# EAGLE design Placa alimentacion (EAGLE 7.5.0)
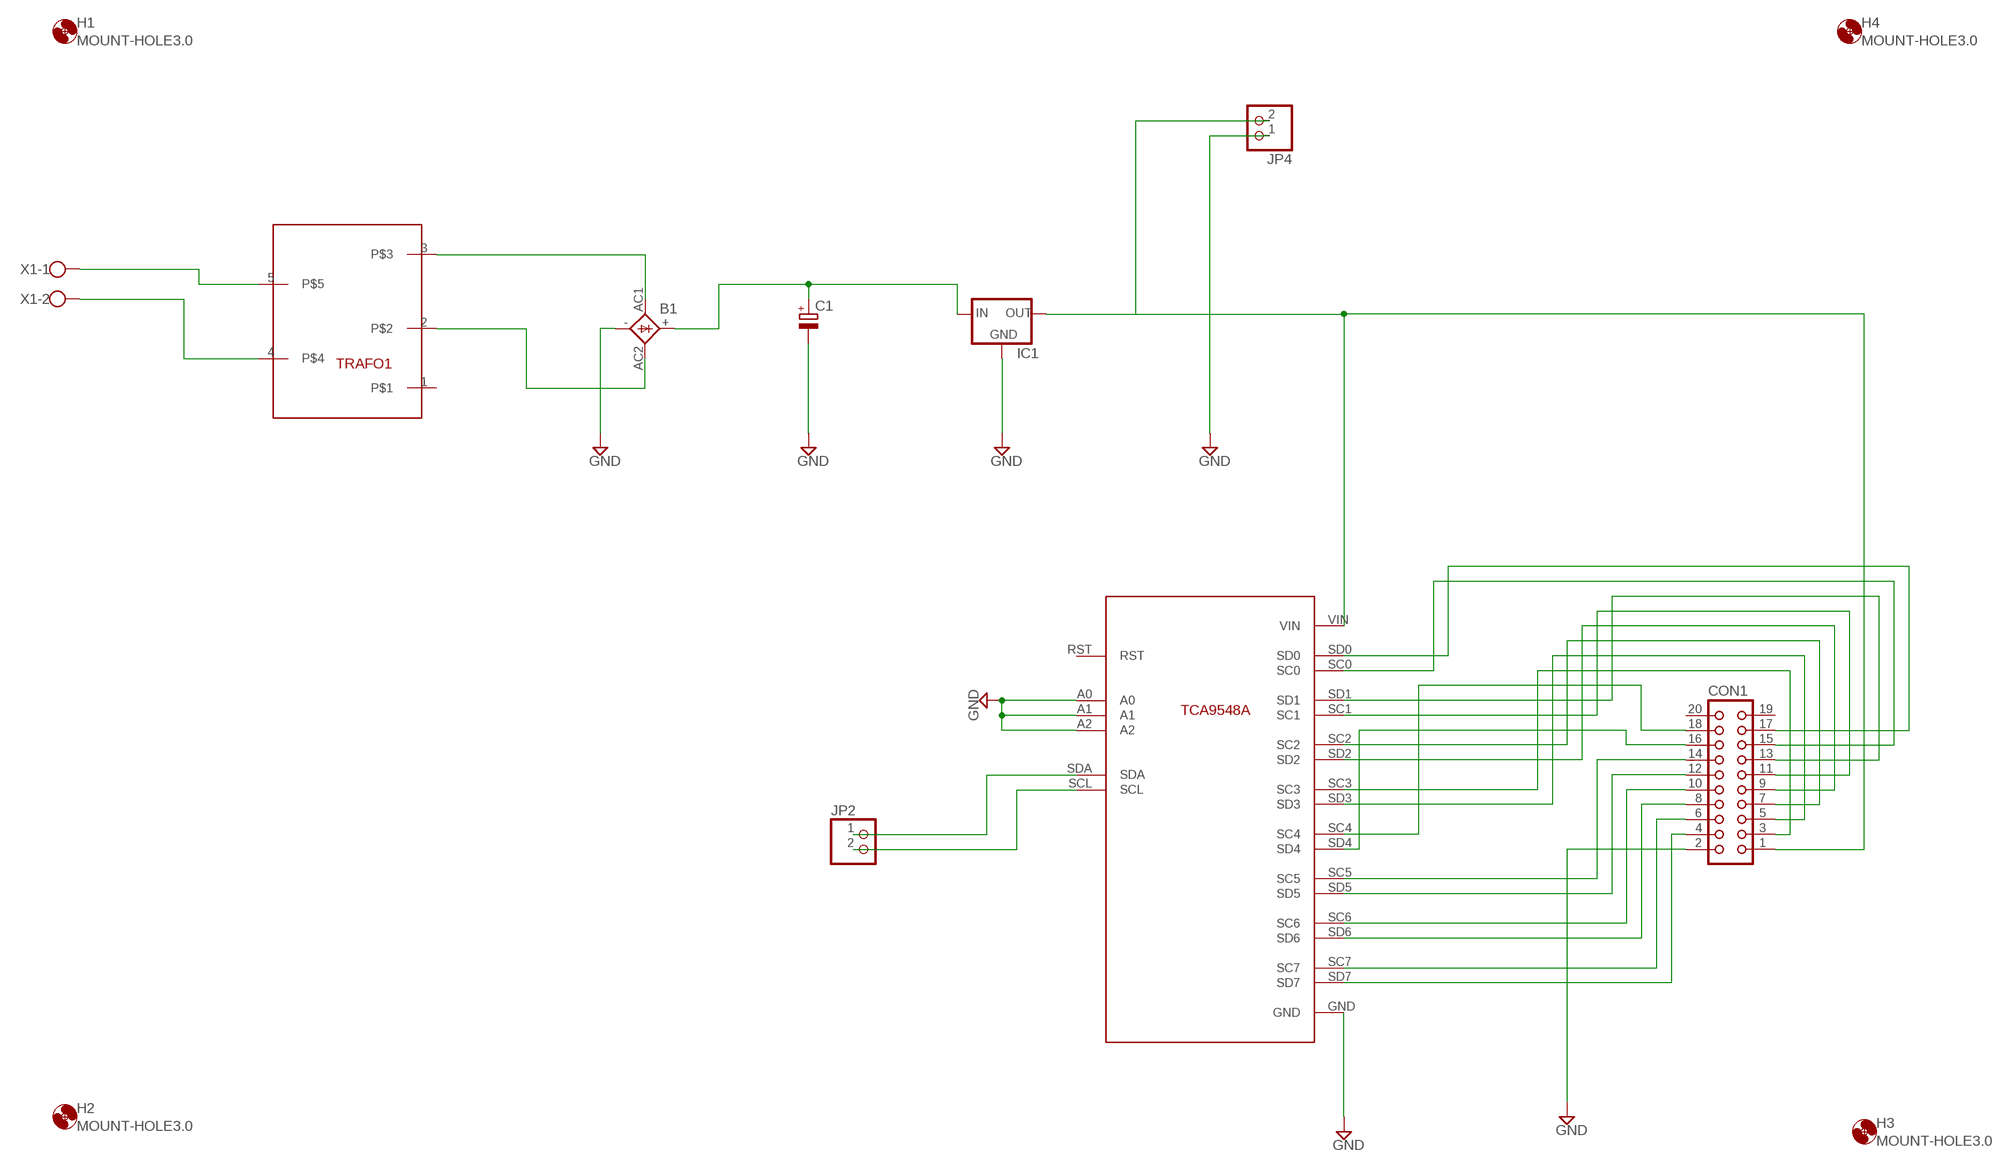
[diagram p0: schematic, sheet 1]

## Parts
B1  KBU  [KBU]
C1  CPOL-EUE5-8.5  [E5-8,5]
CON1  CON20  [CON20]
H1  MOUNT-HOLE3.0  [3,0]
H2  MOUNT-HOLE3.0  [3,0]
H3  MOUNT-HOLE3.0  [3,0]
H4  MOUNT-HOLE3.0  [3,0]
IC1  78MXXL  [78MXXL]
JP2  PINHD-1X2  [1X02]
JP4  PINHD-1X2  [1X02]
TRAFO1  ARISTON_TR5309  [ARISTON_TR5309]
U$1  TCA9548A  [TCA9548A]
X1  W237-102  [W237-102]

## Nets
GND: B1.- C1.- CON1.2 IC1.GND JP4.1 U$1.A0 U$1.A1 U$1.A2 U$1.GND
N$1: TRAFO1.5 X1.1
N$2: TRAFO1.4 X1.2
N$3: B1.AC1 TRAFO1.3
N$4: B1.AC2 TRAFO1.2
N$5: B1.+ C1.+ IC1.IN
N$6: CON1.3 U$1.SC3
N$7: CON1.5 U$1.SD3
N$8: CON1.7 U$1.SC2
N$9: CON1.9 U$1.SD2
N$10: CON1.11 U$1.SC1
N$11: CON1.13 U$1.SD1
N$12: CON1.15 U$1.SC0
N$13: CON1.17 U$1.SD0
N$14: CON1.4 U$1.SD7
N$15: CON1.6 U$1.SC7
N$16: CON1.8 U$1.SD6
N$17: CON1.10 U$1.SC6
N$18: CON1.12 U$1.SD5
N$19: CON1.14 U$1.SC5
N$20: CON1.16 U$1.SD4
N$21: CON1.18 U$1.SC4
N$25: CON1.1 IC1.OUT JP4.2 U$1.VIN
N$30: JP2.1 U$1.SDA
N$31: JP2.2 U$1.SCL
Unconnected: CON1.19 CON1.20 TRAFO1.1 U$1.RST

## Library data of the parts
B1 = rectifier:KBU: DIOTEC RECTIFIER
C1 = rcl:CPOL-EU: POLARIZED CAPACITOR, European symbol
CON1 = con-harting:CON20: CONNECTOR; OC_FARNELL: unknown; OC_NEWARK: unknown
H1-H4 = holes:MOUNT-HOLE: MOUNTING HOLE with drill center marker
IC1 = v-reg:78MXXL: VOLTAGE REGULATOR
JP2 JP4 = pinhead:PINHD-1X2: PIN HEADER
TRAFO1 = CESAR:ARISTON_TR5309
U$1 = CESAR:TCA9548A
X1 = con-wago-500:W237-102: WAGO SCREW CLAMP; MPN: 237-102; OC_FARNELL: unknown; OC_NEWARK: 70K9898

## Board
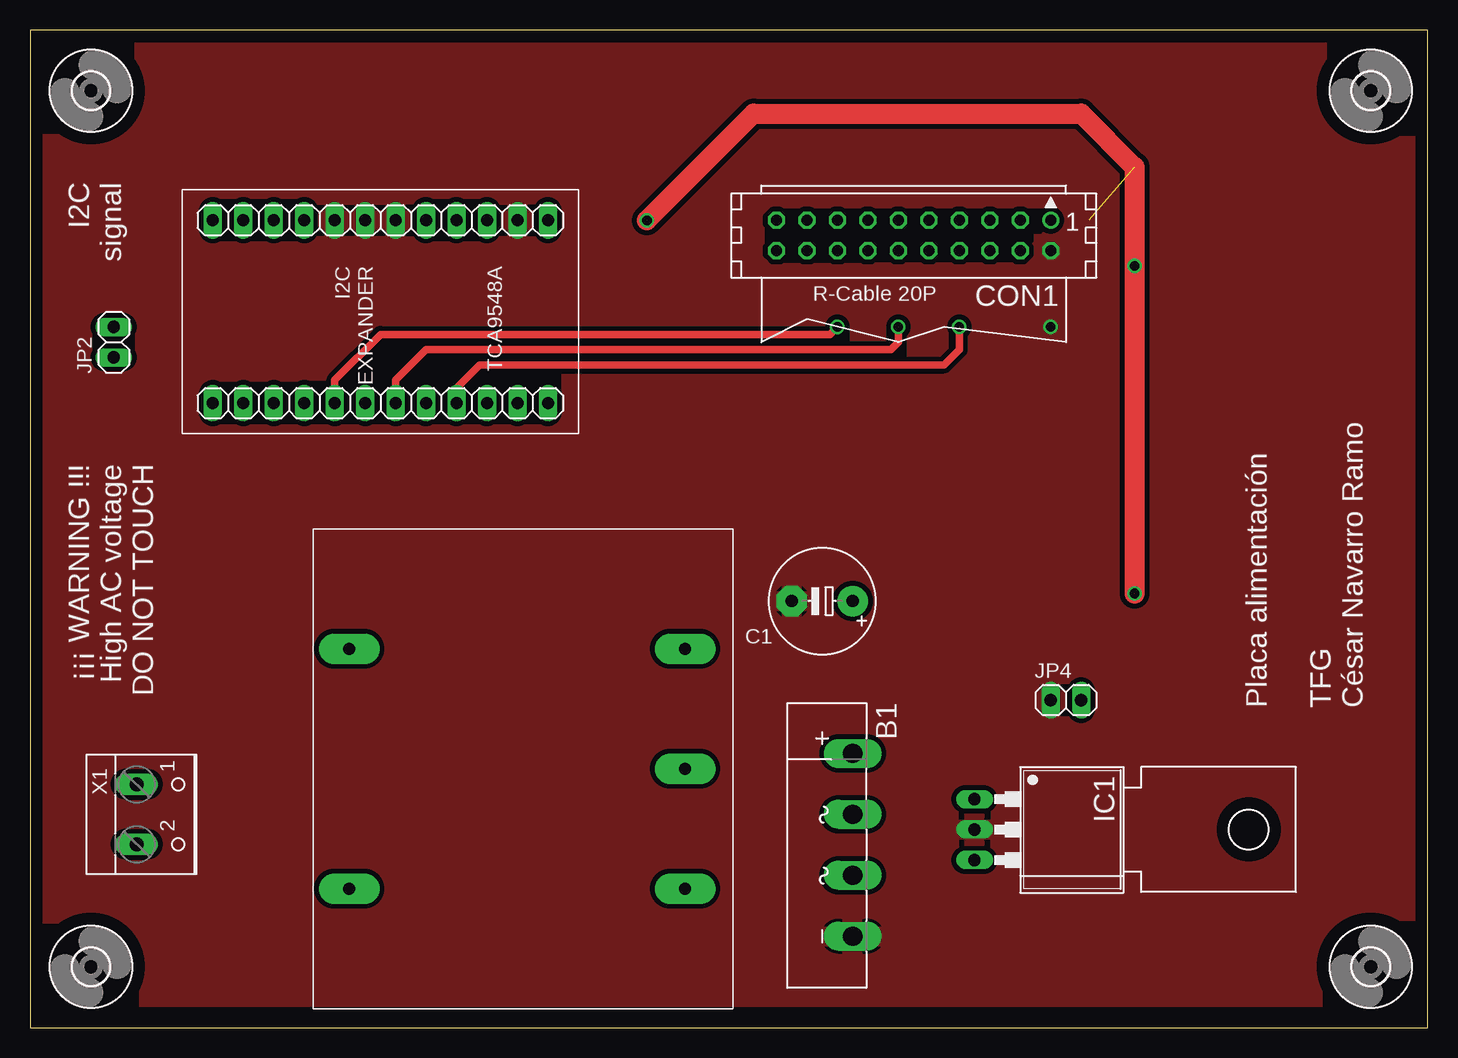
[diagram p1: board, top side]
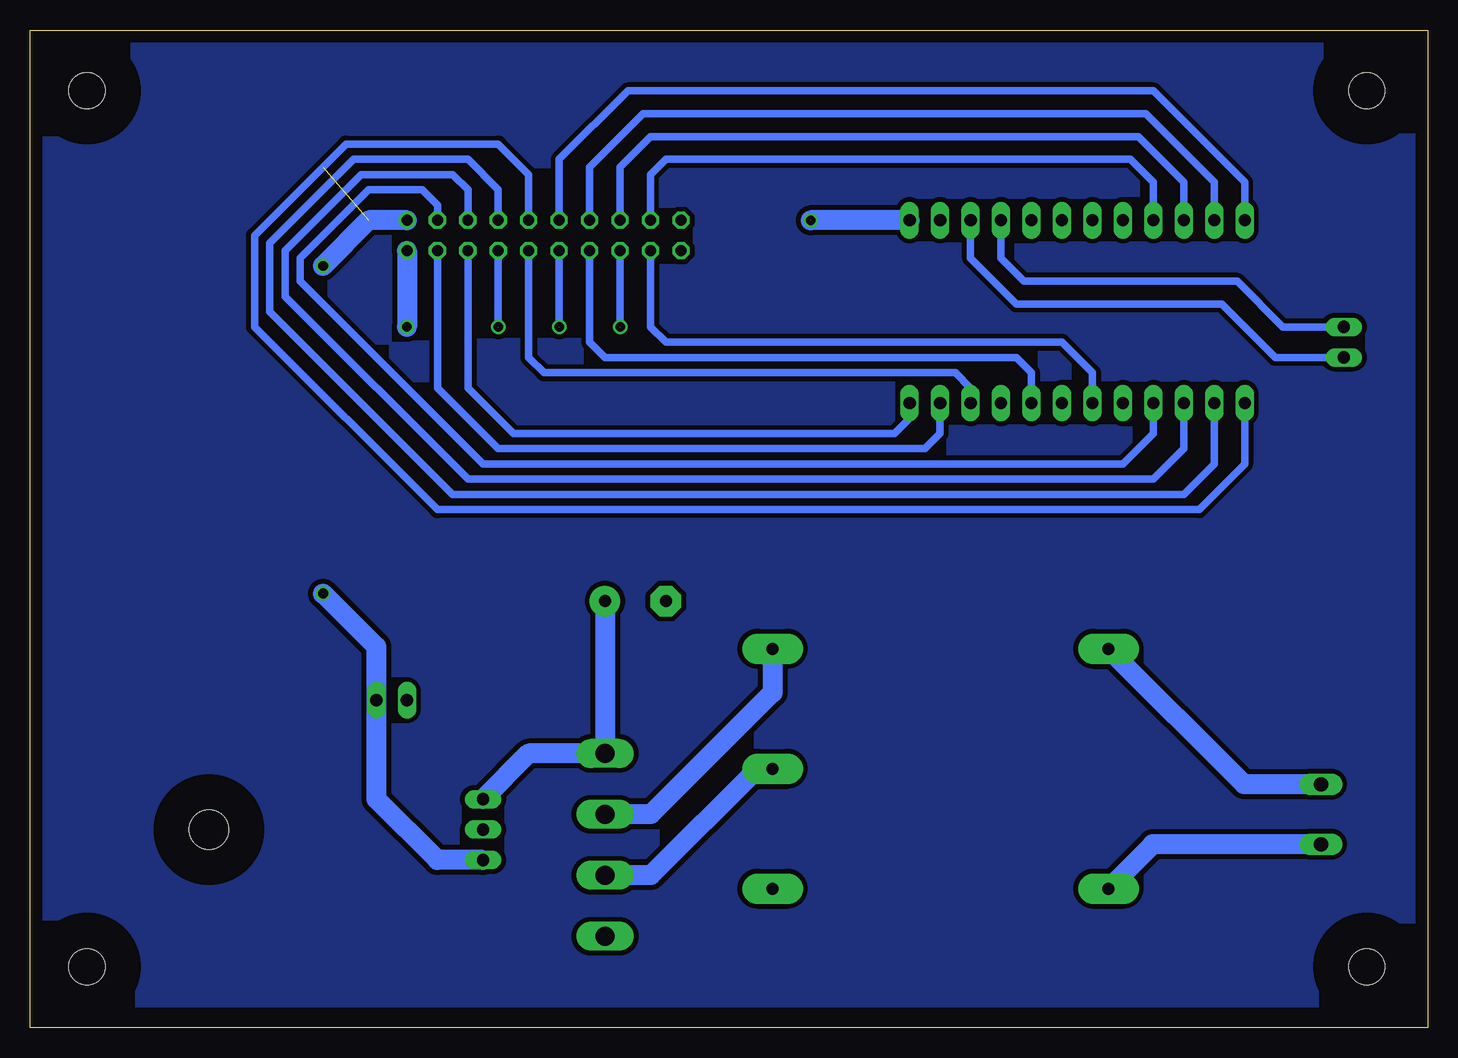
[diagram p2: board, bottom side, seen from below]

Size 116.51 x 83.17 mm. Coordinates in mm from the lower left corner, seen from the top.
Outline: 0,0 116.51,0 116.51,83.17 0,83.17 0,0
Copper layers (1*16): Top 0.035mm / dielectric 1.5mm / Bottom 0.035mm
Design rules "default": minimum track width 10mil, minimum drill 24mil, track to track 8mil, track to pad 8mil, pad to pad 8mil, via to via 8mil, smd to smd 8mil, copper to edge 40mil, drill to drill 8mil, minimum pad ring 10mil, minimum via ring 8mil, stop-mask expansion 4mil, vias tented up to drill 0mil, thermal gap 10mil

### Footprints (pad centres in the part's own frame; a part is rotated, then mirrored left to right if it is on the bottom)
KBU = drill 1.6 long: + -7.62,2.54; - 7.62,2.54; AC1 -2.54,2.54; AC2 2.54,2.54
E5-8,5 = drill 1.016 pad 2.54: + -2.54,0 | drill 1.016 pad 2.54 octagon: - 2.54,0
CON20 = drill 0.914: 1 -11.43,-1.27 | drill 0.914 octagon: 2 -11.43,1.27; 3 -8.89,-1.27; 4 -8.89,1.27; 5 -6.35,-1.27; 6 -6.35,1.27; 7 -3.81,-1.27; 8 -3.81,1.27; 9 -1.27,-1.27; 10 -1.27,1.27; 11 1.27,-1.27; 12 1.27,1.27; 13 3.81,-1.27; 14 3.81,1.27; 15 6.35,-1.27; 16 6.35,1.27; 17 8.89,-1.27; 18 8.89,1.27; 19 11.43,-1.27; 20 11.43,1.27
3,0 = hole 3: 0,0
78MXXL = drill 1.016 long: GND 0,-5.08; IN -2.54,-5.08; OUT 2.54,-5.08 | hole 3.302: 0,17.78
1X02 = drill 1.016 long: 1 -1.27,0; 2 1.27,0
ARISTON_TR5309 = drill 1 pad 2.54 long: 1 -12.7,11.27; 2 -12.7,1.27; 3 -12.7,-8.73; 4 15.3,11.27; 5 15.3,-8.73
TCA9548A = drill 1.016 long: A0 -7.62,-12.7; A1 -7.62,-15.24; A2 -7.62,-17.78; GND -7.62,-2.54; RST -7.62,-10.16; SC0 -7.62,-22.86; SC1 -7.62,-27.94; SC2 7.62,-25.4; SC3 7.62,-20.32; SC4 7.62,-15.24; SC5 7.62,-10.16; SC6 7.62,-5.08; SC7 7.62,0; SCL -7.62,-7.62; SD0 -7.62,-20.32; SD1 -7.62,-25.4; SD2 7.62,-27.94; SD3 7.62,-22.86; SD4 7.62,-17.78; SD5 7.62,-12.7; SD6 7.62,-7.62; SD7 7.62,-2.54; SDA -7.62,-5.08; VIN -7.62,0
W237-102 = drill 1.194 long: 1 -2.5,-1.27; 2 2.5,-1.27

### Placement (x,y rotation side)
B1  66.04,15.24 270 top
C1  66.04,35.56 180 top
CON1  73.66,66.04 180 top
H1  111.76,5.08 0 top
H2  5.08,78.11 0 top
H3  111.76,78.11 0 top
H4  5.08,5.08 0 top
IC1  83.82,16.51 270 top
JP2  6.99,57.15 90 top
JP4  86.36,27.3 0 top
TRAFO1  41.91,22.86 180 top
U$1  43.18,59.69 270 top
X1  10.16,17.78 270 top

### Tracks (layer width: path | path; a pad name or v marks a point on that pad's centre or on a via)
GND  (via drill 0.8)
  Bottom 1.676: CON1.2 v85.09,58.42
  pour Top (isolate 0.406): 1.27,81.92 114.94,81.92 114.94,2.54 1.27,2.54
N$1
  Bottom 1.676: X1.1 15.3,20.28 TRAFO1.5
N$2
  Bottom 1.676: X1.2 22.92,15.28 TRAFO1.4
N$3
  Bottom 1.676: TRAFO1.3 54.61,27.94 64.77,17.78 B1.AC1
N$4
  Bottom 1.676: TRAFO1.2 55.88,21.59 64.77,12.7 B1.AC2
N$5
  Bottom 1.676: C1.+ B1.+ 74.93,22.86 IC1.IN
N$6
  Bottom 0.61: U$1.SC3 22.86,49.53 25.4,46.99 78.74,46.99 93.98,62.23 93.98,64.14 88.27,69.85 83.82,69.85 82.55,68.58 CON1.3
N$7
  Bottom 0.61: U$1.SD3 20.32,48.26 22.86,45.72 80.01,45.72 95.25,60.96 95.25,64.77 88.9,71.12 81.28,71.12 80.01,69.85 CON1.5
N$8
  Bottom 0.61: U$1.SC2 17.78,46.99 20.32,44.45 81.28,44.45 96.52,59.69 96.52,65.41 89.53,72.39 80.01,72.39 77.47,69.85 CON1.7
N$9
  Bottom 0.61: U$1.SD2 15.24,46.99 19.05,43.18 82.55,43.18 97.79,58.42 97.79,66.04 90.17,73.66 77.47,73.66 74.93,71.12 CON1.9
N$10
  Bottom 0.61: U$1.SC1 15.24,70.48 22.86,78.11 66.67,78.11 72.39,72.39 CON1.11
N$11
  Bottom 0.61: CON1.13 69.85,71.75 65.41,76.2 23.5,76.2 17.78,70.48 U$1.SD1
N$12
  Bottom 0.61: U$1.SC0 20.32,70.48 24.13,74.3 64.77,74.3 67.31,71.75 CON1.15
N$13
  Bottom 0.61: CON1.17 64.77,71.12 63.5,72.39 24.77,72.39 22.86,70.48 U$1.SD0
N$14
  Bottom 0.61: CON1.4 82.55,53.34 77.47,48.26 41.91,48.26 40.64,49.53 U$1.SD7
N$15
  Bottom 0.61: CON1.6 80.01,53.34 76.2,49.53 44.45,49.53 43.18,50.8 U$1.SC7
N$16  (1 unrouted)
  Top 0.61: U$1.SD6 35.56,53.34 37.47,55.24 76.2,55.24 77.47,56.52 77.47,58.42
  Bottom 0.61: CON1.8 77.47,58.42
N$17
  Bottom 0.61: CON1.10 74.93,55.88 73.66,54.61 39.37,54.61 38.1,53.34 U$1.SC6
N$18  (1 unrouted)
  Top 0.61: U$1.SD5 30.48,53.98 33.02,56.52 71.75,56.52 72.39,57.15 72.39,58.42
  Bottom 0.61: CON1.12 72.39,58.42
N$19
  Bottom 0.61: CON1.14 69.85,57.15 68.58,55.88 34.29,55.88 33.02,54.61 U$1.SC5
N$20  (1 unrouted)
  Top 0.61: U$1.SD4 25.4,53.98 29.21,57.78 66.67,57.78 67.31,58.42
  Bottom 0.61: CON1.16 67.31,58.42
N$21
  Bottom 0.61: CON1.18 64.77,58.42 63.5,57.15 30.48,57.15 27.94,54.61 U$1.SC4
N$22  (via drill 0.8)
  other vias: 77.47,58.42
N$23  (via drill 0.8)
  other vias: 72.39,58.42
N$24  (via drill 0.8)
  other vias: 67.31,58.42
N$25  (via drill 0.8)  (3 unrouted)
  Top 1.676: 51.44,67.31 60.33,76.2 87.63,76.2 92.08,71.75 92.08,36.2
  Bottom 1.676: IC1.OUT 82.55,13.97 87.63,19.05 JP4.2 87.63,31.75 92.08,36.2 | CON1.1 88.27,67.31 v92.08,63.5 | U$1.VIN 51.44,67.31
N$26  (via drill 0.8)
  other vias: 92.08,36.2
N$27  (via drill 0.8)
  other vias: 51.44,67.31
N$28
  pour Bottom (isolate 0.406): 1.27,81.92 114.94,81.92 114.94,2.54 1.27,2.54 1.27,81.28
N$30
  Bottom 0.61: JP2.1 12.7,55.88 17.14,60.33 34.29,60.33 38.1,64.14 U$1.SDA
N$31
  Bottom 0.61: JP2.2 12.06,58.42 15.88,62.23 33.66,62.23 35.56,64.14 U$1.SCL

### Text on the board
tNames: I2C / signal | ¡¡¡ WARNING !!! / High AC voltage / DO NOT TOUCH | Placa alimentación / / TFG / César Navarro Ramo